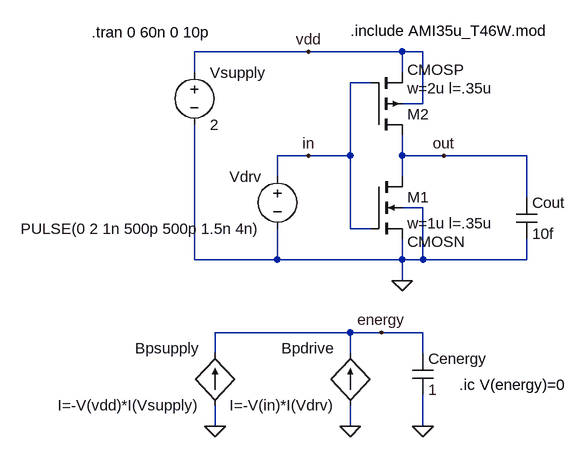
[diagram p0: schematic PowerPlay.asc]
PowerPlay.asc, the LTspice schematic file:
Version 4
SHEET 1 1188 680
WIRE 224 0 48 0
WIRE 368 0 224 0
WIRE 400 0 368 0
WIRE 48 32 48 0
WIRE 368 32 368 0
WIRE 320 48 288 48
WIRE 400 80 400 0
WIRE 400 80 368 80
WIRE 224 160 176 160
WIRE 288 160 288 48
WIRE 288 160 224 160
WIRE 368 160 368 128
WIRE 432 160 368 160
WIRE 560 160 432 160
WIRE 176 192 176 160
WIRE 368 192 368 160
WIRE 560 224 560 160
WIRE 400 240 368 240
WIRE 288 272 288 160
WIRE 320 272 288 272
WIRE 48 320 48 112
WIRE 176 320 176 272
WIRE 176 320 48 320
WIRE 368 320 368 288
WIRE 368 320 176 320
WIRE 400 320 400 240
WIRE 400 320 368 320
WIRE 560 320 560 288
WIRE 560 320 400 320
WIRE 368 352 368 320
WIRE 288 432 80 432
WIRE 336 432 288 432
WIRE 400 432 336 432
WIRE 80 464 80 432
WIRE 288 464 288 432
WIRE 400 464 400 432
WIRE 80 576 80 544
WIRE 288 576 288 544
WIRE 400 576 400 528
FLAG 368 352 0
FLAG 224 0 vdd
FLAG 224 160 in
FLAG 432 160 out
FLAG 288 576 0
FLAG 80 576 0
FLAG 400 576 0
FLAG 336 432 energy
SYMBOL nmos4 320 192 R0
WINDOW 38 56 100 Left 0
SYMATTR InstName M1
SYMATTR Value w=1u l=.35u
SYMATTR SpiceModel CMOSN
SYMBOL pmos4 320 128 M180
WINDOW 38 56 100 Left 0
SYMATTR InstName M2
SYMATTR Value w=2u l=.35u
SYMATTR SpiceModel CMOSP
SYMBOL voltage 48 16 R0
SYMATTR InstName Vsupply
SYMATTR Value 2
SYMBOL voltage 176 176 M0
WINDOW 123 0 0 Left 0
WINDOW 39 0 0 Left 0
SYMATTR InstName Vdrv
SYMATTR Value PULSE(0 2 1n 500p 500p 1.5n 4n)
SYMBOL bi 80 544 R180
WINDOW 0 24 88 Left 0
WINDOW 3 24 0 Left 0
SYMATTR InstName Bpsupply
SYMATTR Value I=-V(vdd)*I(Vsupply)
SYMBOL bi 288 544 R180
WINDOW 0 24 88 Left 0
WINDOW 3 24 0 Left 0
SYMATTR InstName Bpdrive
SYMATTR Value I=-V(in)*I(Vdrv)
SYMBOL cap 384 464 R0
SYMATTR InstName Cenergy
SYMATTR Value 1
SYMBOL cap 544 224 R0
SYMATTR InstName Cout
SYMATTR Value 10f
TEXT 288 -32 Left 0 !.include AMI35u_T46W.mod
TEXT -110 -30 Left 0 !.tran 0 60n 0 10p
TEXT 456 512 Left 0 !.ic V(energy)=0

The netlist it stands for:
* PowerPlay.asc
M1 out in 0 0 CMOSN w=1u l=.35u
M2 out in vdd vdd CMOSP w=2u l=.35u
Vsupply vdd 0 2
Vdrv in 0 PULSE(0 2 1n 500p 500p 1.5n 4n)
Bpsupply 0 energy I=-V(vdd)*I(Vsupply)
Bpdrive 0 energy I=-V(in)*I(Vdrv)
Cenergy energy 0 1
Cout out 0 10f
.model NMOS NMOS
.model PMOS PMOS
.lib standard.mos
.include AMI35u_T46W.mod
.tran 0 60n 0 10p
.ic V(energy)=0
.backanno
.end